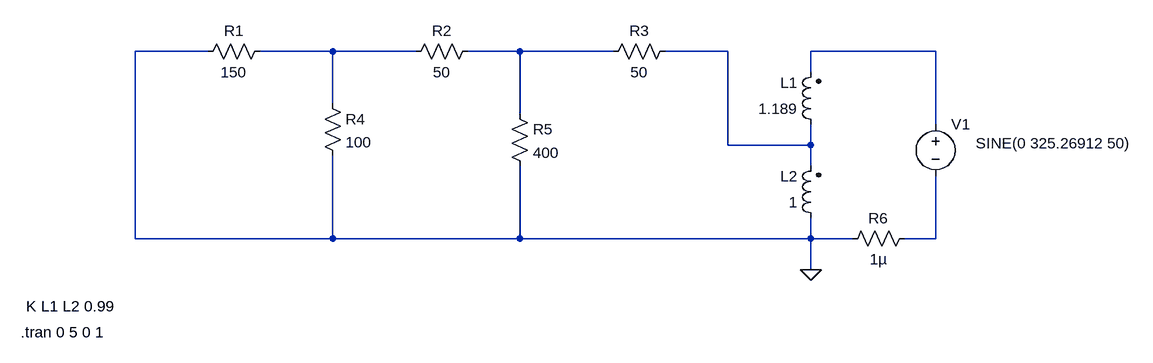
[diagram p0: schematic Expt1_Part2_Case2.asc]
Expt1_Part2_Case2.asc, the LTspice schematic file:
Version 4
SHEET 1 1828 680
WIRE 384 -32 272 -32
WIRE 576 -32 464 -32
WIRE 704 -32 576 -32
WIRE 864 -32 784 -32
WIRE 1008 -32 864 -32
WIRE 1184 -32 1088 -32
WIRE 1504 -32 1312 -32
WIRE 1312 0 1312 -32
WIRE 576 48 576 -32
WIRE 864 64 864 -32
WIRE 1504 80 1504 -32
WIRE 1184 112 1184 -32
WIRE 1312 112 1312 80
WIRE 1312 112 1184 112
WIRE 1312 144 1312 112
WIRE 272 256 272 -32
WIRE 576 256 576 128
WIRE 576 256 272 256
WIRE 864 256 864 144
WIRE 864 256 576 256
WIRE 1312 256 1312 224
WIRE 1312 256 864 256
WIRE 1376 256 1312 256
WIRE 1504 256 1504 160
WIRE 1504 256 1456 256
WIRE 1312 304 1312 256
FLAG 1312 304 0
SYMBOL ind2 1328 96 R180
WINDOW 0 36 80 Left 2
WINDOW 3 36 40 Left 2
SYMATTR InstName L1
SYMATTR Value 1.189
SYMATTR Type ind
SYMBOL ind2 1328 240 R180
WINDOW 0 36 80 Left 2
WINDOW 3 36 40 Left 2
SYMATTR InstName L2
SYMATTR Value 1
SYMATTR Type ind
SYMBOL voltage 1504 64 R0
WINDOW 3 62 45 Left 2
WINDOW 123 0 0 Left 0
WINDOW 39 0 0 Left 0
SYMATTR Value SINE(0 325.26912 50)
SYMATTR InstName V1
SYMBOL res 480 -48 R90
WINDOW 0 0 56 VBottom 2
WINDOW 3 32 56 VTop 2
SYMATTR InstName R1
SYMATTR Value 150
SYMBOL res 1472 240 R90
WINDOW 0 0 56 VBottom 2
WINDOW 3 32 56 VTop 2
SYMATTR InstName R6
SYMATTR Value 1µ
SYMBOL res 560 32 R0
SYMATTR InstName R4
SYMATTR Value 100
SYMBOL res 848 48 R0
SYMATTR InstName R5
SYMATTR Value 400
SYMBOL res 800 -48 R90
WINDOW 0 0 56 VBottom 2
WINDOW 3 32 56 VTop 2
SYMATTR InstName R2
SYMATTR Value 50
SYMBOL res 1104 -48 R90
WINDOW 0 0 56 VBottom 2
WINDOW 3 32 56 VTop 2
SYMATTR InstName R3
SYMATTR Value 50
TEXT 104 360 Left 2 !K L1 L2 0.99
TEXT 96 400 Left 2 !.tran 0 5 0 1

The netlist it stands for:
* Expt1_Part2_Case2.asc
L1 N003 N004 1.189
L2 0 N003 1
V1 N004 N005 SINE(0 325.26912 50)
R1 N001 0 150
R6 N005 0 1µ
R4 N001 0 100
R5 N002 0 400
R2 N002 N001 50
R3 N003 N002 50
K L1 L2 0.99
.tran 0 5 0 1
.backanno
.end